# Altium schematic sheet Front(QC_PD).SchDoc
size A4; SheetNumber: 3; SheetTotal: 4
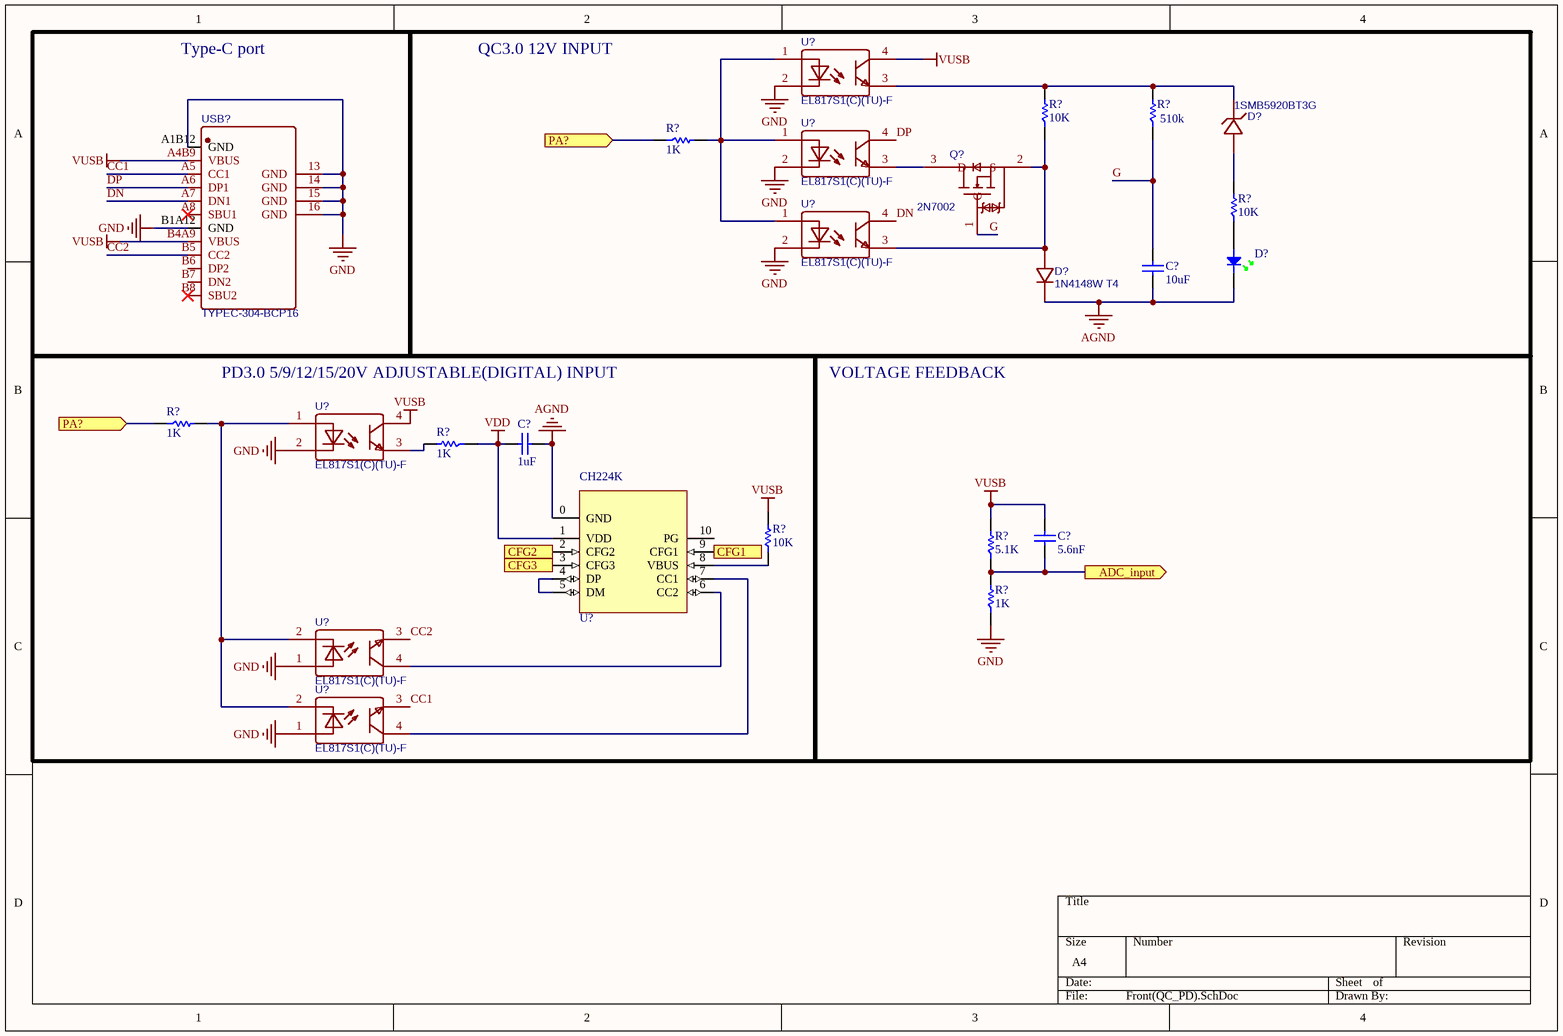
[diagram p0: Front(QC_PD).SchDoc]

## Parts
(Parts that share a designator on the sheet are numbered #1, #2 ... from top to bottom, then left to right.)
C?#1  10uF  [0805C]
C?#2  1uF  [0805C]
C?#3  5.6nF  [0805C]
D?#1  1SMB5920BT3G  [SMB_L4.6-W3.6-LS5.3-RD]
D?#2  (no value)  [0805D-GREEN]
D?#3  1N4148W T4  [SOD-123_L2.8-W1.8-LS3.7-RD]
Q?  2N7002  [SOT-23-3_L2.9-W1.3-P1.90-LS2.4-BR]
R?#1  10K  [0805]
R?#2  510k  [0805]
R?#3  1K  [0805]
R?#4  10K  [0805]
R?#5  1K  [0805]
R?#6  1K  [0805]
R?#7  10K  [0805]
R?#8  5.1K  [0805]
R?#9  1K  [0805]
U?#1  EL817S1(C)(TU)-F  [OPTO-SMD-4_L4.6-W6.5-P2.54-LS10.3-TL]
U?#2  EL817S1(C)(TU)-F  [OPTO-SMD-4_L4.6-W6.5-P2.54-LS10.3-TL]
U?#3  EL817S1(C)(TU)-F  [OPTO-SMD-4_L4.6-W6.5-P2.54-LS10.3-TL]
U?#4  EL817S1(C)(TU)-F  [OPTO-SMD-4_L4.6-W6.5-P2.54-LS10.3-TL]
U?#5  CH224K  [ESSOP10]
U?#6  EL817S1(C)(TU)-F  [OPTO-SMD-4_L4.6-W6.5-P2.54-LS10.3-TL]
U?#7  EL817S1(C)(TU)-F  [OPTO-SMD-4_L4.6-W6.5-P2.54-LS10.3-TL]
USB?  TYPEC-304-BCP16  [USB-C-SMD_TYPEC-304-BCP16]

## Blocks framed on the sheet
Type-C port: USB?
QC3.0 12V INPUT: C?#1 D?#1-D?#3 Q? R?#1-R?#4 U?#1-U?#3
PD3.0 5/9/12/15/20V ADJUSTABLE(DIGITAL) INPUT: C?#2 R?#5-R?#7 U?#4-U?#7
VOLTAGE FEEDBACK: C?#3 R?#8 R?#9

## Ports
ADC_input (out), CFG1 (in), CFG2 (in), CFG3 (in), PA? (in)

## Nets
AGND: C?#1.2 C?#2.1 D?#2.K D?#3.1(K) U?#5.0(GND)
GND: R?#9.1 U?#1.2(CAT) U?#2.2(CAT) U?#3.2(CAT) U?#4.2(CAT) U?#6.1(AN) U?#7.1(AN) USB?.13(GND) USB?.14(GND) USB?.15(GND) USB?.16(GND) USB?.A1B12(GND) USB?.B1A12(GND)
VDD: C?#2.2 R?#6.1 U?#5.1(VDD)
VUSB: C?#3.1 R?#7.2 R?#8.2 U?#1.4(COL) U?#4.4(COL) USB?.A4B9(VBUS) USB?.B4A9(VBUS)
ADC_input: C?#3.2 R?#8.1 R?#9.2 ; port ADC_input
CC1: U?#7.3(EM) USB?.A5(CC1)
CC2: U?#6.3(EM) USB?.B5(CC2)
CFG1: U?#5.9(CFG1) ; port CFG1
CFG2: U?#5.2(CFG2) ; port CFG2
CFG3: U?#5.3(CFG3) ; port CFG3
DN: U?#3.4(COL) USB?.A7(DN1)
DP: U?#2.4(COL) USB?.A6(DP1)
G: C?#1.1 Q?.1(G) R?#2.1
PA?: R?#3.1 R?#5.1 ; port PA?
NetD?#1_1: D?#1.1(K) R?#1.2 R?#2.2 U?#1.3(EM)
NetD?#1_2: D?#1.2(A) R?#4.2
NetD?#2_A: D?#2.A R?#4.1
NetD?#3_2: D?#3.2(A) Q?.2(S) R?#1.1 U?#3.3(EM)
NetQ?_3: Q?.3(D) U?#2.3(EM)
NetR?#3_2: R?#3.2 U?#1.1(AN) U?#2.1(AN) U?#3.1(AN)
NetR?#5_2: R?#5.2 U?#4.1(AN) U?#6.2(CAT) U?#7.2(CAT)
NetR?#6_2: R?#6.2 U?#4.3(EM)
NetR?#7_1: R?#7.1 U?#5.8(VBUS)
NetU?#5_4: U?#5.4(DP) U?#5.5(DM)
NetU?#5_6: U?#5.6(CC2) U?#6.4(COL)
NetU?#5_7: U?#5.7(CC1) U?#7.4(COL)

Not connected (* = marked no-connect by the designer): U?#5 10(PG); USB? A8(SBU1)* B6(DP2) B7(DN2) B8(SBU2)*

## Library data of the parts
C?#1 = C_5: Capacitor; Reviewed by: RM - 2018/08/05; Revision: July-2002: Re-released for DXP Platform.; Supplier 1: *; Supplier Part Number 1: *; Value: 10uF
C?#2 = C_3: Capacitor; Reviewed by: RM - 2018/08/05; Revision: July-2002: Re-released for DXP Platform.; Supplier 1: *; Supplier Part Number 1: *; Value: 1uF
C?#3 = C_7: Capacitor; Reviewed by: RM - 2018/08/05; Revision: July-2002: Re-released for DXP Platform.; Supplier 1: *; Supplier Part Number 1: *; Value: 5.6nF
D?#1 = 1SMB5920BT3G: BOM_Manufacturer: ON; BOM_Supplier: LCSC; BOM_Manufacturer Part: 1SMB5920BT3G; BOM_Supplier Part: C50527; BOM_JLCPCB Part Class: Extended Part; spicePre: D; spiceSymbolName: 1SMB5920BT3G
D?#2 = LED GREEN: Light Emitting Diode; Reviewed by: RM - 2018/08/05; Revision: July-2002: Re-released for DXP Platform.; Supplier 1: Digi-Key; Supplier Part Number 1: 160-1423-1-ND
D?#3 = 1N4148W T4: BOM_Manufacturer: CJ; Contributor: 立创EDA官方封装库; BOM_Supplier: LCSC; BOM_Manufacturer Part: 1N4148W T4; BOM_Supplier Part: C2099; BOM_JLCPCB Part Class: Extended Part; spicePre: D; spiceSymbolName: 1N4148W T4
Q? = 2N7002: BOM_Manufacturer: JSMSEMI(杰盛微); Contributor: LCSC; BOM_Supplier: LCSC; BOM_Supplier Part: C916396; BOM_Manufacturer Part: 2N7002; BOM_JLCPCB Part Class: Extended Part; spicePre: Q; spiceSymbolName: 2N7002_C916396
R?#1 R?#4 R?#7 = R_8: Resistor; Reviewed by: RM - 2018/08/05; Supplier 1: *; Suppler Part Number 1: *; Value: 10K
R?#2 = R_4: Resistor; Reviewed by: RM - 2018/08/05; Supplier 1: *; Suppler Part Number 1: *; Value: 510k
R?#3 R?#5 R?#6 R?#9 = R_6: Resistor; Reviewed by: RM - 2018/08/05; Supplier 1: *; Suppler Part Number 1: *; Value: 1K
R?#8 = R_1: Resistor; Reviewed by: RM - 2018/08/05; Supplier 1: *; Suppler Part Number 1: *; Value: 5.1K
U?#1-U?#4 U?#6 U?#7 = EL817S1(C)(TU)-F: BOM_Manufacturer: EVERLIGHT; BOM_Supplier: LCSC; BOM_Manufacturer Part: EL817S1(C)(TU)-F; BOM_Supplier Part: C106900; BOM_JLCPCB Part Class: Basic Part; spicePre: U; spiceSymbolName: EL817S1(C)(TU)-F
U?#5 = CH224K: USB PD & Type-C & Fast Charge Power Consumer Controller
USB? = TYPEC-304-BCP16: BOM_Manufacturer: XUNPU; Contributor: LCSC; BOM_Supplier: LCSC; BOM_Supplier Part: C720629; BOM_Manufacturer Part: TYPEC-304-BCP16; BOM_JLCPCB Part Class: Extended Part; spicePre: U; spiceSymbolName: TYPEC-304-BCP16